# EAGLE design PC (EAGLE 9.6.2)
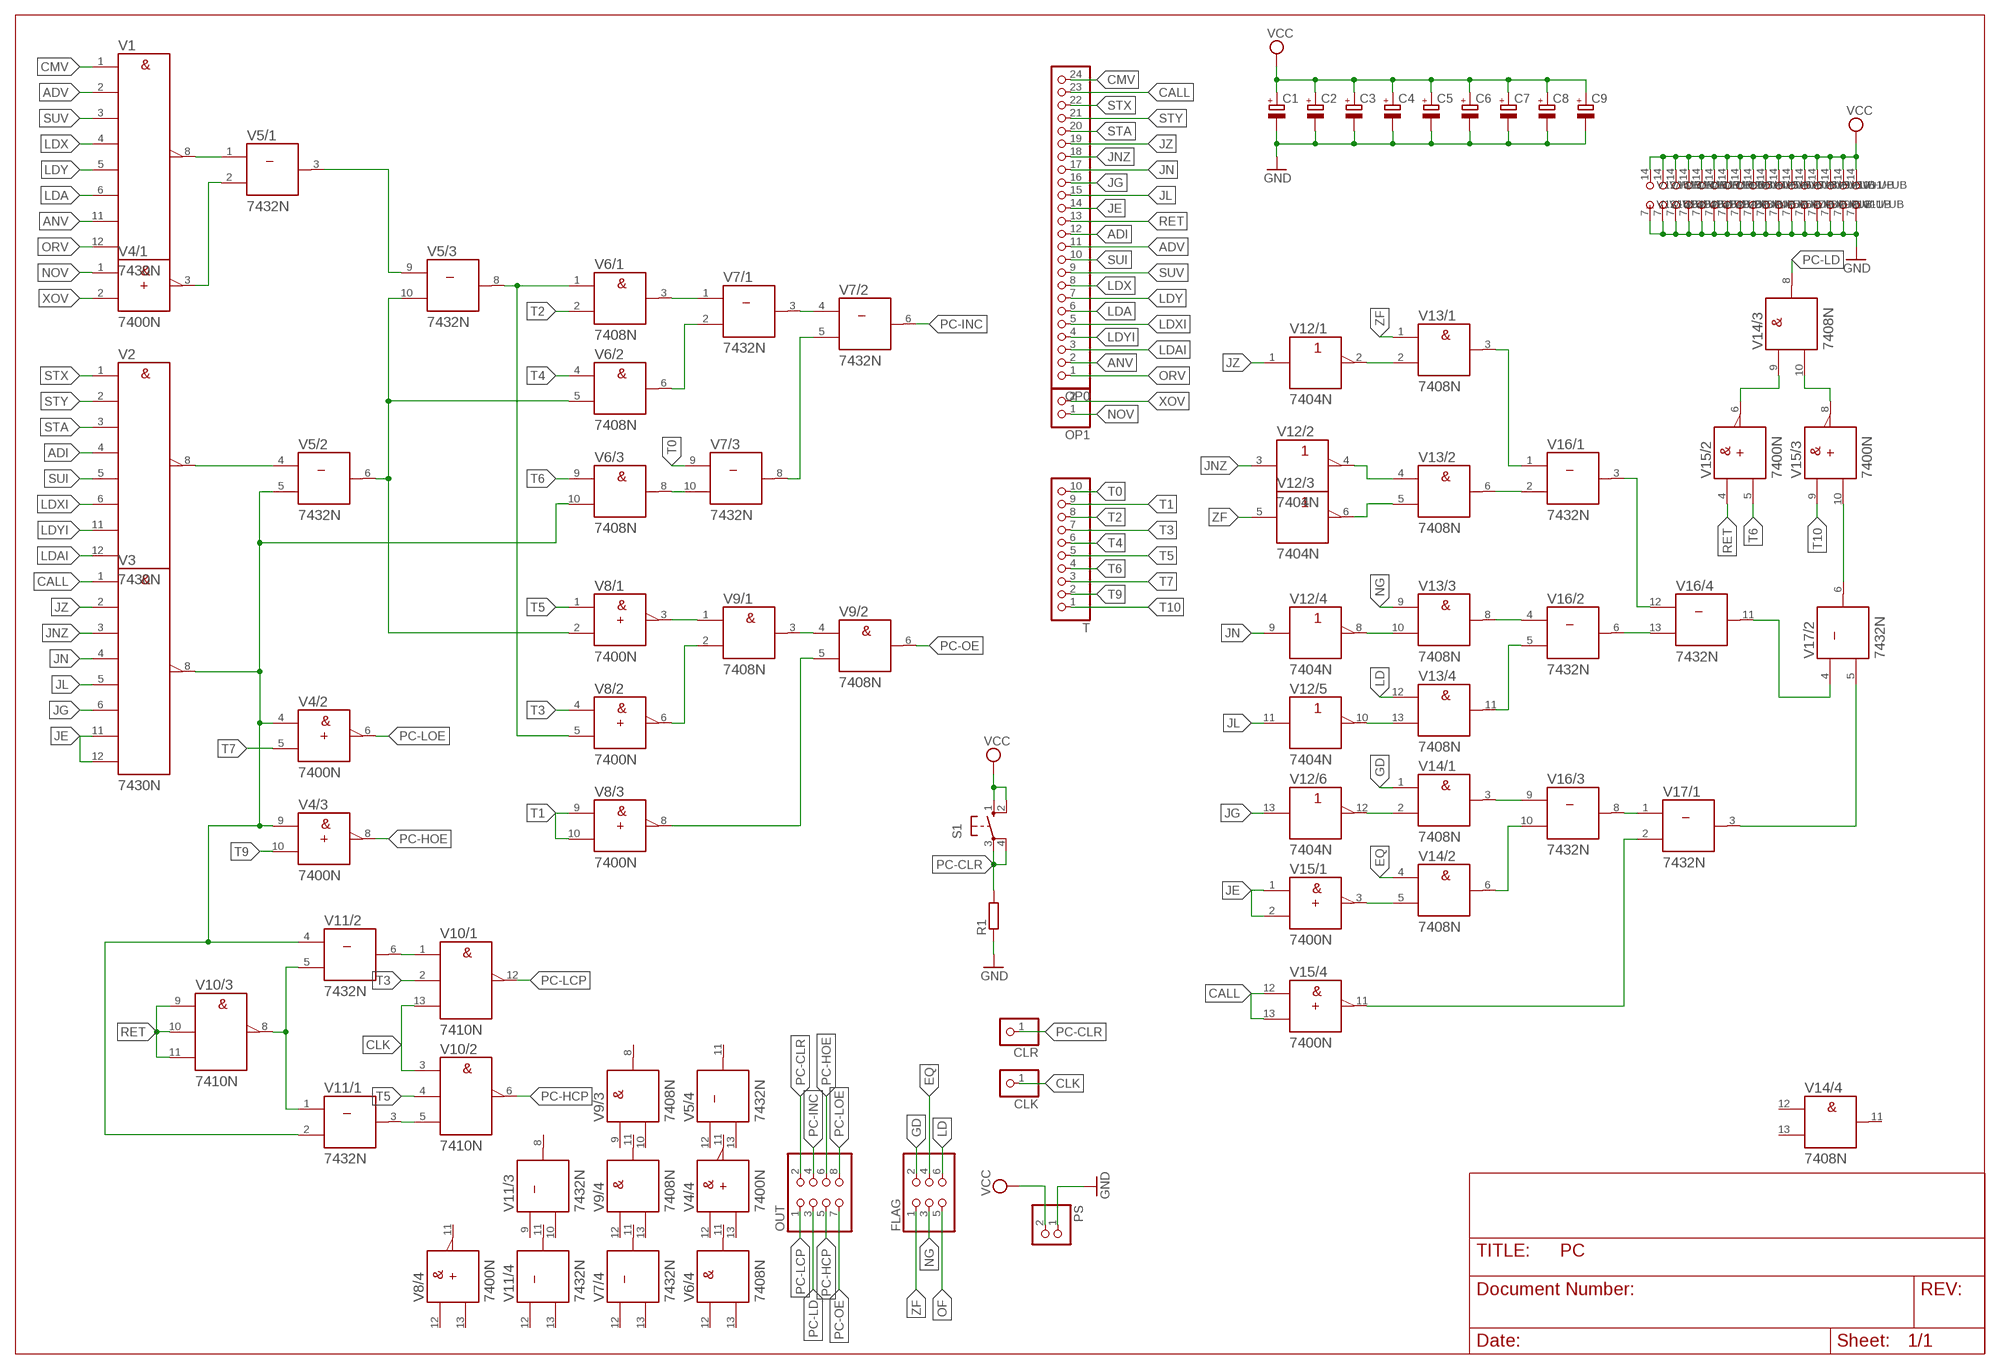
[diagram p0: schematic, sheet 1]

## Parts
C1  CPOL-EUE2.5-6  [E2,5-6]
C2  CPOL-EUE2.5-6  [E2,5-6]
C3  CPOL-EUE2.5-6  [E2,5-6]
C4  CPOL-EUE2.5-6  [E2,5-6]
C5  CPOL-EUE2.5-6  [E2,5-6]
C6  CPOL-EUE2.5-6  [E2,5-6]
C7  CPOL-EUE2.5-6  [E2,5-6]
C8  CPOL-EUE2.5-6  [E2,5-6]
C9  CPOL-EUE2.5-6  [E2,5-6]
CLK  PINHD-1X1  [1X01]
CLR  PINHD-1X1  [1X01]
FLAG  PINHD-2X3  [2X03]
OP0  PINHD-1X24  [1X24]
OP1  PINHD-1X2  [1X02]
OUT  PINHD-2X4  [2X04]
PS  PINHD-1X2  [1X02]
R1  R-EU_0207/7  [0207/7]
S1  10-XX  [B3F-10XX]
T  PINHD-1X10  [1X10]
V1  7430N  [DIL14]
V2  7430N  [DIL14]
V3  7430N  [DIL14]
V4  7400N  [DIL14]
V5  7432N  [DIL14]
V6  7408N  [DIL14]
V7  7432N  [DIL14]
V8  7400N  [DIL14]
V9  7408N  [DIL14]
V10  7410N  [DIL14]
V11  7432N  [DIL14]
V12  7404N  [DIL14]
V13  7408N  [DIL14]
V14  7408N  [DIL14]
V15  7400N  [DIL14]
V16  7432N  [DIL14]
V17  7432N  [DIL14]

## Nets
ADI: OP0.12 V2.4(D)
ADV: OP0.11 V1.2(B)
ANV: OP0.2 V1.11(G)
CALL: OP0.23 V3.1(A) V15.12(/4:A) V15.13(/4:B)
CLK: CLK.1 V10.3(/2:A) V10.13(/1:C)
CMV: OP0.24 V1.1(A)
EQ: FLAG.4 V14.4(/2:A)
GD: FLAG.2 V14.1(/1:A)
GND: C1.- C2.- C3.- C4.- C5.- C6.- C7.- C8.- C9.- PS.1 R1.1 V1.7(-UB) V2.7(-UB) V3.7(-UB) V4.7(/-UB:-UB) V5.7(/-UB:-UB) V6.7(/-UB:-UB) V7.7(/-UB:-UB) V8.7(/-UB:-UB) V9.7(/-UB:-UB) V10.7(/-UB:-UB) V11.7(/-UB:-UB) V12.7(/-UB:-UB) V13.7(/-UB:-UB) V14.7(/-UB:-UB) V15.7(/-UB:-UB) V16.7(/-UB:-UB) V17.7(/-UB:-UB)
JE: OP0.14 V3.11(G) V3.12(H) V15.1(/1:A) V15.2(/1:B)
JG: OP0.16 V3.6(F) V12.13(/6:A)
JL: OP0.15 V3.5(E) V12.11(/5:A)
JN: OP0.17 V3.4(D) V12.9(/4:A)
JNZ: OP0.18 V3.3(C) V12.3(/2:A)
JZ: OP0.19 V3.2(B) V12.1(/1:A)
LD: FLAG.6 V13.12(/4:A)
LDA: OP0.6 V1.6(F)
LDAI: OP0.3 V2.12(H)
LDX: OP0.8 V1.4(D)
LDXI: OP0.5 V2.6(F)
LDY: OP0.7 V1.5(E)
LDYI: OP0.4 V2.11(G)
N$1: V12.2(/1:Y) V13.2(/1:B)
N$2: V13.3(/1:Y) V16.1(/1:A)
N$3: V12.4(/2:Y) V13.4(/2:A)
N$4: V10.5(/2:C) V11.3(/1:Y)
N$5: V12.6(/3:Y) V13.5(/2:B)
N$6: V13.6(/2:Y) V16.2(/1:B)
N$7: V10.1(/1:A) V11.6(/2:Y)
N$8: V10.8(/3:Y) V11.1(/1:A) V11.5(/2:B)
N$9: V12.8(/4:Y) V13.10(/3:B)
N$10: V12.10(/5:Y) V13.13(/4:B)
N$11: V13.8(/3:Y) V16.4(/2:A)
N$12: V13.11(/4:Y) V16.5(/2:B)
N$13: V14.6(/2:Y) V16.10(/3:B)
N$14: V12.12(/6:Y) V14.2(/1:B)
N$15: V14.3(/1:Y) V16.9(/3:A)
N$16: V14.5(/2:B) V15.3(/1:Y)
N$17: V5.6(/2:Y) V5.10(/3:B) V6.5(/2:B) V8.2(/1:B)
N$18: V6.6(/2:Y) V7.2(/1:B)
N$19: V5.8(/3:Y) V6.1(/1:A) V8.5(/2:B)
N$20: V6.3(/1:Y) V7.1(/1:A)
N$21: V7.5(/2:B) V7.8(/3:Y)
N$22: V4.3(/1:Y) V5.2(/1:B)
N$23: V5.3(/1:Y) V5.9(/3:A)
N$24: V7.3(/1:Y) V7.4(/2:A)
N$25: V1.8(Y) V5.1(/1:A)
N$26: V2.8(Y) V5.4(/2:A)
N$27: V3.8(Y) V4.4(/2:A) V4.9(/3:A) V5.5(/2:B) V6.10(/3:B) V11.2(/1:B) V11.4(/2:A)
N$28: V16.6(/2:Y) V16.13(/4:B)
N$29: V6.8(/3:Y) V7.10(/3:B)
N$30: V16.3(/1:Y) V16.12(/4:A)
N$31: V16.8(/3:Y) V17.1(/1:A)
N$32: V8.3(/1:Y) V9.1(/1:A)
N$33: V8.6(/2:Y) V9.2(/1:B)
N$34: V8.8(/3:Y) V9.5(/2:B)
N$35: V9.3(/1:Y) V9.4(/2:A)
N$36: V15.11(/4:Y) V17.2(/1:B)
N$38: V14.10(/3:B) V15.8(/3:Y)
N$39: V14.9(/3:A) V15.6(/2:Y)
N$42: V15.10(/3:B) V17.6(/2:Y)
N$43: V16.11(/4:Y) V17.4(/2:A)
N$44: V17.3(/1:Y) V17.5(/2:B)
NG: FLAG.3 V13.9(/3:A)
NOV: OP1.1 V4.1(/1:A)
OF: FLAG.5
ORV: OP0.1 V1.12(H)
PC-CLR: CLR.1 OUT.2 R1.2 S1.3(P) S1.4(P1)
PC-HCP: OUT.5 V10.6(/2:Y)
PC-HOE: OUT.6 V4.8(/3:Y)
PC-INC: OUT.4 V7.6(/2:Y)
PC-LCP: OUT.1 V10.12(/1:Y)
PC-LD: OUT.3 V14.8(/3:Y)
PC-LOE: OUT.8 V4.6(/2:Y)
PC-OE: OUT.7 V9.6(/2:Y)
RET: OP0.13 V10.9(/3:A) V10.10(/3:B) V10.11(/3:C) V15.4(/2:A)
STA: OP0.20 V2.3(C)
STX: OP0.22 V2.1(A)
STY: OP0.21 V2.2(B)
SUI: OP0.10 V2.5(E)
SUV: OP0.9 V1.3(C)
T0: T.10 V7.9(/3:A)
T1: T.9 V8.9(/3:A) V8.10(/3:B)
T2: T.8 V6.2(/1:B)
T3: T.7 V8.4(/2:A) V10.2(/1:B)
T4: T.6 V6.4(/2:A)
T5: T.5 V8.1(/1:A) V10.4(/2:B)
T6: T.4 V6.9(/3:A) V15.5(/2:B)
T7: T.3 V4.5(/2:B)
T9: T.2 V4.10(/3:B)
T10: T.1 V15.9(/3:A)
VCC: C1.+ C2.+ C3.+ C4.+ C5.+ C6.+ C7.+ C8.+ C9.+ PS.2 S1.1(S) S1.2(S1) V1.14(+UB) V2.14(+UB) V3.14(+UB) V4.14(/+UB:+UB) V5.14(/+UB:+UB) V6.14(/+UB:+UB) V7.14(/+UB:+UB) V8.14(/+UB:+UB) V9.14(/+UB:+UB) V10.14(/+UB:+UB) V11.14(/+UB:+UB) V12.14(/+UB:+UB) V13.14(/+UB:+UB) V14.14(/+UB:+UB) V15.14(/+UB:+UB) V16.14(/+UB:+UB) V17.14(/+UB:+UB)
XOV: OP1.2 V4.2(/1:B)
ZF: FLAG.1 V12.5(/3:A) V13.1(/1:A)
Unconnected: V4.11(/4:Y) V4.12(/4:A) V4.13(/4:B) V5.11(/4:Y) V5.12(/4:A) V5.13(/4:B) V6.11(/4:Y) V6.12(/4:A) V6.13(/4:B) V7.11(/4:Y) V7.12(/4:A) V7.13(/4:B) V8.11(/4:Y) V8.12(/4:A) V8.13(/4:B) V9.8(/3:Y) V9.9(/3:A) V9.10(/3:B) V9.11(/4:Y) V9.12(/4:A) V9.13(/4:B) V11.8(/3:Y) V11.9(/3:A) V11.10(/3:B) V11.11(/4:Y) V11.12(/4:A) V11.13(/4:B) V14.11(/4:Y) V14.12(/4:A) V14.13(/4:B) V17.8(/3:Y) V17.9(/3:A) V17.10(/3:B) V17.11(/4:Y) V17.12(/4:A) V17.13(/4:B)

## Library data of the parts
C1-C9 = rcl:CPOL-EU: POLARIZED CAPACITOR, European symbol; SPICEPREFIX: C
CLK CLR = pinhead:PINHD-1X1: PIN HEADER
FLAG = pinhead:PINHD-2X3: PIN HEADER
OP0 = pinhead:PINHD-1X24: PIN HEADER
OP1 PS = pinhead:PINHD-1X2: PIN HEADER
OUT = pinhead:PINHD-2X4: PIN HEADER
R1 = rcl:R-EU_: RESISTOR, European symbol; SPICEPREFIX: R
S1 = switch-omron:10-XX: OMRON SWITCH; MPN: B3F-1000; OC_FARNELL: 176432; OC_NEWARK: 36M3542
T = pinhead:PINHD-1X10: PIN HEADER
V1-V3 = 74ttl-din:74*30: 8-input NAND gate
V4 V8 V15 = 74ttl-din:74*00: Quad 2-input NAND gate
V5 V7 V11 V16 V17 = 74ttl-din:74*32: Quad 2-input OR gate
V6 V9 V13 V14 = 74ttl-din:74*08: Quad 2-input AND gate
V10 = 74ttl-din:74*10: Triple 3-input NAND gate
V12 = 74ttl-din:74*04: Hex INVERTER

## Board
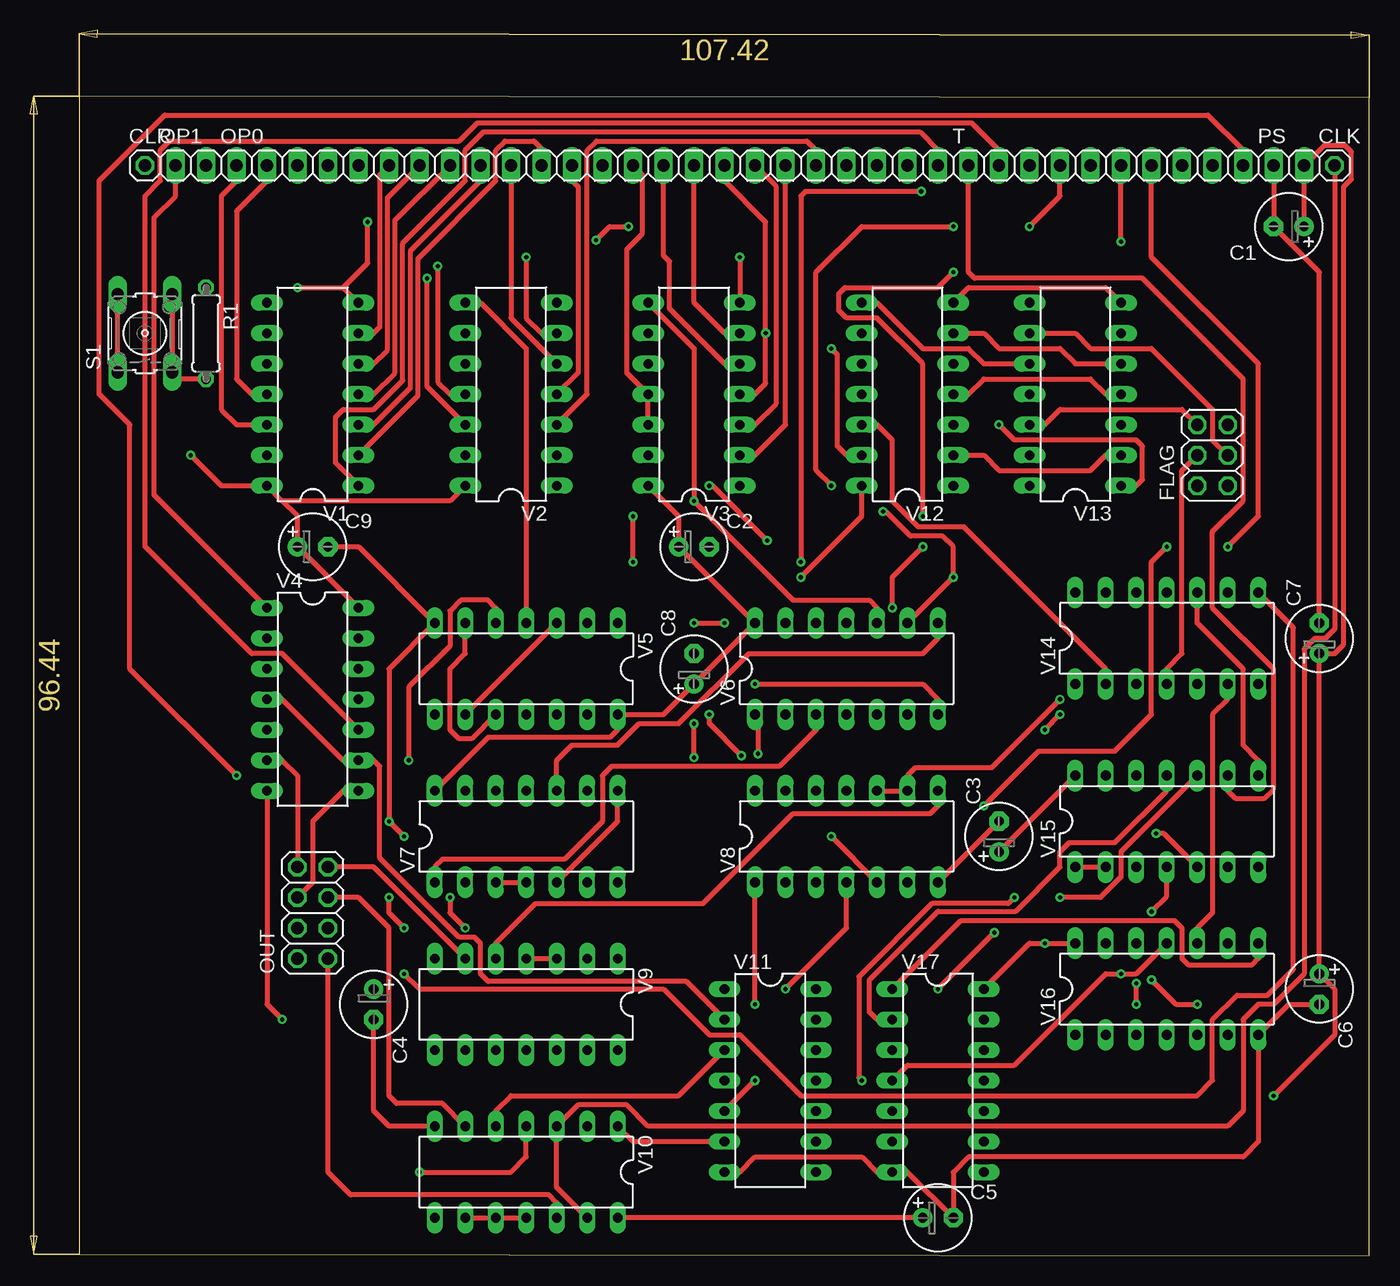
[diagram p1: board, top side]
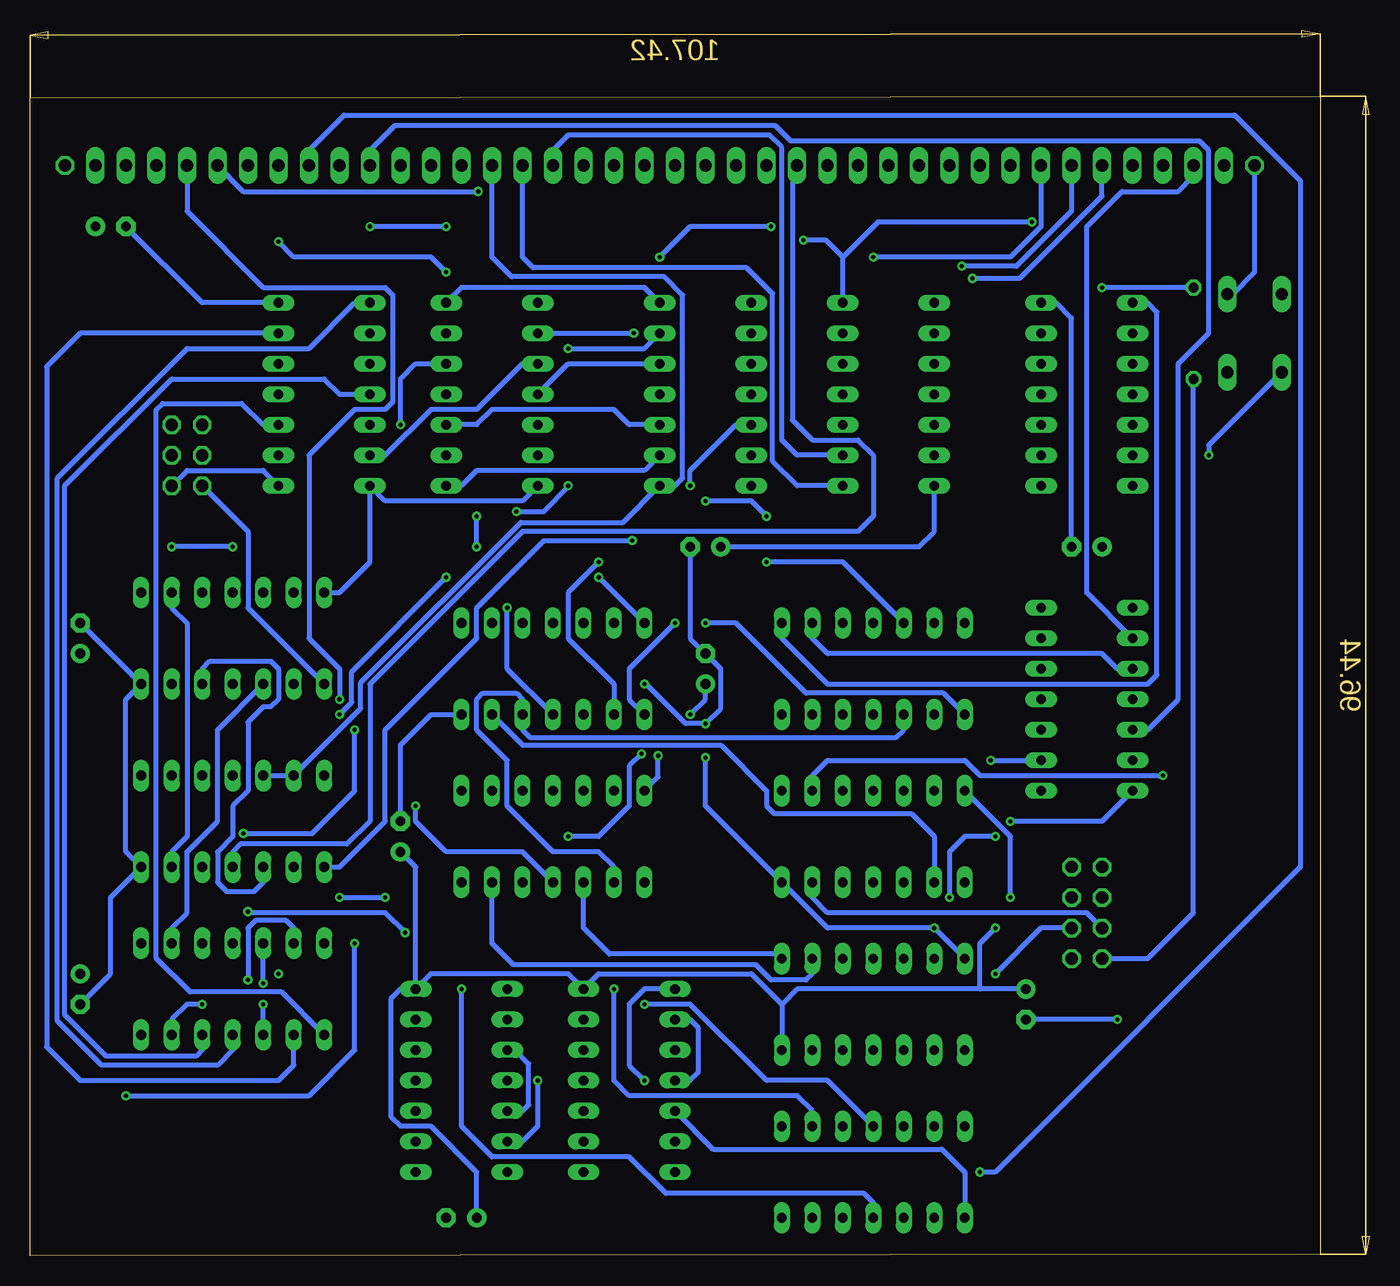
[diagram p2: board, bottom side, seen from below]

Size 107.42 x 96.57 mm. Coordinates in mm from the lower left corner, seen from the top.
Outline: 0,0.13 107.42,0 107.42,96.44 0,96.57 0,0.13
Copper layers (1*16): Top 0.035mm / dielectric 1.5mm / Bottom 0.035mm
Design rules "default": minimum track width 6mil, minimum drill 0.35mm, track to track 6mil, track to pad 6mil, pad to pad 6mil, via to via 6mil, smd to smd 6mil, copper to edge 40mil, drill to drill 6mil, minimum pad ring 10mil, minimum via ring 8mil, stop-mask expansion 4mil, vias tented up to drill 0mil, thermal gap 10mil

### Footprints (pad centres in the part's own frame; a part is rotated, then mirrored left to right if it is on the bottom)
E2,5-6 = drill 0.813 pad 1.6: + -1.27,0 | drill 0.813 pad 1.6 octagon: - 1.27,0
1X01 = drill 1.016 octagon: 1 0,0
2X03 = drill 1.016 octagon: 1 -2.54,-1.27; 2 -2.54,1.27; 3 0,-1.27; 4 0,1.27; 5 2.54,-1.27; 6 2.54,1.27
1X24 = drill 1.016 long: 1 -29.21,0; 2 -26.67,0; 3 -24.13,0; 4 -21.59,0; 5 -19.05,0; 6 -16.51,0; 7 -13.97,0; 8 -11.43,0; 9 -8.89,0; 10 -6.35,0; 11 -3.81,0; 12 -1.27,0; 13 1.27,0; 14 3.81,0; 15 6.35,0; 16 8.89,0; 17 11.43,0; 18 13.97,0; 19 16.51,0; 20 19.05,0; 21 21.59,0; 22 24.13,0; 23 26.67,0; 24 29.21,0
1X02 = drill 1.016 long: 1 -1.27,0; 2 1.27,0
2X04 = drill 1.016 octagon: 1 -3.81,-1.27; 2 -3.81,1.27; 3 -1.27,-1.27; 4 -1.27,1.27; 5 1.27,-1.27; 6 1.27,1.27; 7 3.81,-1.27; 8 3.81,1.27
0207/7 = drill 0.813 octagon: 1 -3.81,0; 2 3.81,0
B3F-10XX = drill 1.016 long: 1 -3.251,2.261; 2 3.251,2.261; 3 -3.251,-2.261; 4 3.251,-2.261
1X10 = drill 1.016 long: 1 -11.43,0; 2 -8.89,0; 3 -6.35,0; 4 -3.81,0; 5 -1.27,0; 6 1.27,0; 7 3.81,0; 8 6.35,0; 9 8.89,0; 10 11.43,0
DIL14 = drill 0.813 long: 1 -7.62,-3.81; 2 -5.08,-3.81; 3 -2.54,-3.81; 4 0,-3.81; 5 2.54,-3.81; 6 5.08,-3.81; 7 7.62,-3.81; 8 7.62,3.81; 9 5.08,3.81; 10 2.54,3.81; 11 0,3.81; 12 -2.54,3.81; 13 -5.08,3.81; 14 -7.62,3.81

### Placement (x,y rotation side)
C1  100.71,85.72 180 top
C2  51.18,59.05 0 top
C3  76.58,34.93 90 top
C4  24.51,20.95 270 top
C5  71.5,3.17 0 top
C6  103.25,22.22 270 top
C7  103.25,51.44 90 top
C8  51.18,48.9 90 top
C9  19.43,59.05 0 top
CLK  104.52,90.8 0 top
CLR  5.46,90.8 0 top
FLAG  94.36,66.67 90 top
OP0  42.29,90.8 0 top
OP1  9.27,90.8 0 top
OUT  19.43,28.57 90 top
PS  100.71,90.8 0 top
R1  10.54,76.83 270 top
S1  5.46,76.83 90 top
T  85.47,90.8 0 top
V1  19.43,71.75 90 top
V2  35.94,71.75 90 top
V3  51.18,71.75 90 top
V4  19.43,46.36 270 top
V5  37.21,48.9 180 top
V6  63.88,48.9 0 top
V7  37.21,34.93 0 top
V8  63.88,34.93 0 top
V9  37.21,20.95 180 top
V10  37.21,6.98 180 top
V11  57.53,14.61 270 top
V12  68.96,71.75 90 top
V13  82.93,71.75 90 top
V14  90.55,51.44 0 top
V15  90.55,36.2 0 top
V16  90.55,22.22 0 top
V17  71.5,14.61 270 top

### Tracks (layer width: path | path; a pad name or v marks a point on that pad's centre or on a via)
ADI
  Top 0.4: OP0.12 41.02,89.53 41.53,89.03 41.53,73.53 V2.4
ADV
  Top 0.4: V1.2 28.19,71.63 28.19,83.06 34.67,89.53 34.67,92.07 35.43,92.84 37.85,92.84 38.48,92.2 OP0.11
ANV
  Top 0.4: OP0.2 15.62,89.53 13.08,86.99 13.08,73.02 14.35,71.75 V1.11
CALL
  Bottom 0.4: OP0.23 68.96,83.19 67.31,81.53 54.61,81.53 53.09,80.01 53.09,64.77 53.72,64.13 V3.1 58.04,61.09 66.55,61.09 79.88,47.75 79.88,45.59 V15.13 V15.12
CLK
  Top 0.4: V10.13 39.75,5.71 V10.3 41.53,12.57 45.59,12.57 47.37,10.79 95.63,10.79 96.9,12.07 96.9,19.68 98.17,20.95 99.44,20.95 101.98,23.49 101.98,50.53 102.89,51.44 103.76,51.44 104.52,52.2 CLK.1
CMV
  Top 0.4: V1.1 21.34,66.04 21.34,69.85 21.97,70.48 24.51,70.48 26.92,72.9 26.92,84.33 32.13,89.53 32.13,92.07 33.66,93.6 69.98,93.6 71.5,92.07 OP0.24
EQ
  Top 0.4: V14.4 90.55,48.9 91.82,50.16 91.82,65.41 FLAG.4
GD
  Bottom 0.4: FLAG.2 89.28,60.33 89.28,53.98 V14.1
GND  (via drill 0.35)
  Top 0.4: V12.7 74.04,80.64 85.47,80.64 V13.7 | C4.- 24.51,12.07 25.78,10.79 V10.7 | V11.7 54.99,6.98 56.26,8.26 65.15,8.26 66.42,6.98 V17.7 68.96,6.98 C5.- 72.77,6.98 74.04,8.26 96.9,8.26 98.17,9.53 V16.7 100.71,20.95 C6.- | C7.- 103.25,81.91 C1.- PS.1 | C9.- 23.24,59.05 V5.7 25.78,48.9 v25.78,36.2 v27.05,34.93 | V8.7 C3.- | v18.16,80.64 21.97,80.64 | 21.97,80.64 V1.7 | 21.97,80.64 24,82.68 v24,86.11 | v16.89,19.68 15.62,20.95 V4.7 | v30.86,29.84 30.86,28.57 v32.13,27.3 | v43.02,84.58 44.16,85.72 v45.72,85.72 | v54.99,83.19 V3.7 | v51.18,41.5 v51.18,44.32 | v56.26,47.62 70.23,47.62 71.5,46.36 V6.7
  Bottom 0.4: V3.7 56.26,80.64 71.5,80.64 V12.7 | R1.1 v18.16,80.64 | v24,86.11 36.83,86.11 39.75,83.19 | V2.7 39.75,83.19 | v16.89,19.68 C4.- | V4.7 18.16,36.2 v25.78,36.2 | v27.05,34.93 29.59,34.93 30.86,33.66 v30.86,29.84 | V9.7 v32.13,27.3 41.02,27.3 V7.7 51.18,37.47 v51.18,41.5 | C6.- 100.71,23.49 100.71,29.84 V15.7 99.44,33.66 99.44,46.36 V14.7 C7.- | C2.- 52.45,51.44 C8.- 49.91,48.9 49.91,45.59 v51.18,44.32 52.83,44.32 56.13,47.62 v56.26,47.62 | V13.7 93.09,79.38 C1.- | C3.- 76.58,42.55 74.04,45.09 V6.7 | 39.75,83.19 41.15,84.58 v43.02,84.58 | v45.72,85.72 52.45,85.72 v54.99,83.19 | C9.- 20.7,78.1 21.97,79.38 V1.7
JE  (via drill 0.35)
  Top 0.4: V3.12 V3.11 45.59,73.53 45.59,83.82 46.86,85.09 46.86,90.04 OP0.14 | V15.1 V15.2 | v57.28,59.56 52.7,64.13 v52.45,64.13
  Bottom 0.4: V15.1 81.66,32.39 77.85,36.2 77.85,43.82 70.23,51.44 70.23,53.98 64.64,59.56 v57.28,59.56 | v52.45,64.13 52.45,65.41 48.64,69.21 V3.12
JG  (via drill 0.35)
  Top 0.4: V3.6 53.72,76.83 51.18,79.38 OP0.16 | V12.13 63.88,66.67 63.12,67.44 63.12,75.06 v62.61,75.56
  Bottom 0.4: v62.61,75.56 56.26,75.56 V3.6
JL
  Top 0.4: V3.5 53.72,74.3 49.15,78.87 49.15,82.8 48.64,83.31 OP0.15
  Bottom 0.4: V12.11 62.61,74.3 V3.5
JN  (via drill 0.35)
  Top 0.4: V3.4 56.26,71.75 57.15,72.64 v57.15,76.83 57.15,86.11 53.72,89.53 OP0.17
  Bottom 0.4: V12.9 v57.15,76.83
JNZ
  Top 0.4: V3.3 56.26,69.21 58.04,70.99 58.04,89.03 OP0.18
  Bottom 0.4: V12.3 70.23,69.21 68.96,70.48 58.8,70.48 57.53,69.21 V3.3
JZ
  Top 0.4: V3.2 56.26,66.67 58.8,69.21 OP0.19
  Bottom 0.4: V3.2 56.26,65.41 70.23,65.41 71.5,64.13 V12.1
LD
  Top 0.4: V13.12 80.39,69.21 81.66,70.48 91.82,70.48 FLAG.6
LDA
  Top 0.4: V1.6 24.51,76.83 25.02,77.34 25.02,90.04 OP0.6
LDAI  (via drill 0.35)
  Top 0.4: V2.12 28.96,72.39 v28.96,81.41
  Bottom 0.4: v28.96,81.41 25.02,81.41 18.16,88.27 OP0.3
LDX
  Top 0.4: V1.4 24.51,71.75 26.29,73.53 26.29,86.23 OP0.8
LDXI  (via drill 0.35)
  Top 0.4: v37.21,83.19 37.21,78.1 38.48,76.83 V2.6
  Bottom 0.4: OP0.5 23.24,85.72 25.78,83.19 v37.21,83.19
LDY
  Top 0.4: V1.5 24.51,74.3 25.65,75.44 25.65,88.14 OP0.7
LDYI  (via drill 0.35)
  Top 0.4: v29.84,82.42 29.84,72.77 30.86,71.75 V2.11
  Bottom 0.4: OP0.4 20.7,86.99 25.27,82.42 v29.84,82.42
N$1
  Top 0.4: V13.2 85.47,66.67 84.2,65.41 76.58,65.41 75.31,66.67 V12.2
N$2
  Bottom 0.4: V16.1 86.49,21.97 94.11,21.97 96.9,24.77 96.9,70.48 96.39,70.99 89.79,70.99 88.01,69.21 V13.3
N$3
  Top 0.4: V12.4 74.04,71.75 75.31,73.02 84.2,73.02 85.47,71.75 V13.4
N$4
  Top 0.4: V10.5 34.67,12.07 35.94,13.34 49.91,13.34 V11.3
N$5
  Top 0.4: V12.6 75.31,76.83 76.58,75.56 81.66,75.56 82.93,74.3 V13.5
N$6
  Bottom 0.4: V16.2 85.47,15.88 86.74,14.61 103.25,14.61 106.05,17.4 106.05,74.04 103.25,76.83 V13.6
N$7
  Top 0.4: V10.1 46.1,9.53 V11.6
N$8  (via drill 0.35)
  Top 0.4: v56.26,14.61 V11.5
  Bottom 0.4: V11.5 50.55,8.89 31.5,8.89 29.59,6.98 V10.8 | V11.1 56.26,22.22 57.53,20.95 57.53,15.88 v56.26,14.61
N$9
  Top 0.4: V12.8 66.42,79.38 70.23,75.56 74.04,75.56 75.31,74.3 V13.10
N$10
  Bottom 0.4: V12.10 66.42,74.3 70.23,70.48 74.04,70.48 77.85,66.67 V13.13
N$11
  Bottom 0.4: V16.4 90.55,17.14 91.82,15.88 101.47,15.88 105.16,19.56 105.16,64.77 94.36,75.56 84.2,75.56 80.39,79.38 V13.8
N$12
  Bottom 0.4: V16.5 93.09,17.14 93.6,16.64 101.09,16.64 104.52,20.07 104.52,64.13 95.63,73.02 82.93,73.02 81.66,71.75 V13.11
N$13
  Top 0.4: V14.6 95.63,46.36 94.36,45.09 94.36,28.57 93.09,27.3 V16.10
N$14
  Top 0.4: V14.2 85.47,48.9 73.66,60.71 69.85,60.71 67.69,62.87 67.69,67.94 66.42,69.21 V12.12
N$15
  Bottom 0.4: V16.9 95.63,27.3 94.36,28.57 94.36,33.66 91.82,36.2 91.82,43.82 V14.3
N$16
  Bottom 0.4: V14.5 93.09,48.9 92.46,49.53 87.38,49.53 86.74,48.9 86.74,46.36 87.38,45.72 88.01,45.72 89.28,44.45 89.28,38.73 90.55,37.47 90.55,34.93 91.82,33.66 91.82,31.11 91.06,30.35 88.77,30.35 88.01,31.11 V15.3
N$17
  Top 0.4: V5.6 32.13,50.16 30.86,48.9 30.86,43.82 31.62,43.05 32.64,43.05 V5.10
  Bottom 0.4: V8.2 58.8,32.39 60.07,33.66 63.88,33.66 67.69,37.47 67.69,41.28 70.23,43.82 70.23,46.36 69.72,46.86 66.93,46.86 66.42,46.36 V6.5 66.42,43.82 65.79,43.18 35.31,43.18 34.67,43.82 V5.10
N$18
  Bottom 0.4: V7.2 32.13,34.93 34.04,36.83 45.47,36.83 46.1,37.47 46.1,38.73 49.91,42.55 66.42,42.55 V6.6
N$19  (via drill 0.35)
  Top 0.4: V6.1 56.52,44.83 v56.52,41.81 | v62.61,34.93 V8.5 | v51.18,52.71 v53.72,52.71
  Bottom 0.4: v56.52,41.81 57.53,40.8 57.53,37.47 60.07,34.93 v62.61,34.93 | v51.18,52.71 48.64,52.71 42.8,46.86 31.37,46.86 V5.8 | v53.72,52.71 57.53,48.9 57.53,46.36 V6.1
N$20
  Top 0.4: V6.3 61.34,43.82 58.29,40.77 44.32,40.77 43.56,40.01 43.56,36.2 40.39,33.02 30.23,33.02 29.59,32.39 V7.1
N$21
  Top 0.4: V7.5 44.83,36.2 V7.8
N$22
  Bottom 0.4: V4.3 16.89,48.9 18.16,50.16 41.02,50.16 42.29,51.44 V5.2
N$23
  Top 0.4: V5.9 V5.3
N$24
  Top 0.4: V7.3 V7.4
N$25
  Bottom 0.4: V5.1 44.83,51.44 41.02,47.62 14.35,47.62 13.59,48.39 13.59,78.61 14.35,79.38 V1.8
N$26
  Top 0.4: V2.8 33.4,79.38 37.21,75.56 V5.4
N$27  (via drill 0.35)
  Top 0.4: V4.4 16.89,46.36 21.97,41.28 V4.9 24.51,41.28 25.02,40.77 25.02,33.15 31.62,26.54 32.89,26.54 33.4,26.04 33.4,23.49 34.04,22.86 50.55,22.86 V11.2 | V6.10 66.42,53.98 65.79,54.61 59.44,54.61 v51.18,62.87 51.18,75.56 V3.8 | v46.1,57.79 v46.1,61.6 | V5.5 34.67,53.98 34.04,54.61 31.75,54.61 30.86,53.72 30.86,50.8 27.43,47.37 v27.43,41.28
  Bottom 0.4: V11.2 52.45,19.68 51.82,19.05 51.82,15.24 52.45,14.61 V11.4 | V5.5 39.75,57.79 v46.1,57.79 | v46.1,61.6 47.37,62.87 v51.18,62.87 | v27.43,41.28 V4.9
N$28  (via drill 0.35)
  Top 0.4: v89.28,22.99 91.31,20.95 v93.09,20.95
  Bottom 0.4: V16.13 85.47,27.3 86.11,27.94 88.65,27.94 89.28,27.3 v89.28,22.99 | v93.09,20.95 94.36,20.95 95.63,19.68 V16.6
N$29
  Top 0.4: V7.10 39.75,41.28 41.02,42.55 44.83,42.55 46.61,44.32 49.91,44.32 55.75,50.16 70.23,50.16 71.5,51.44 V6.8
N$30  (via drill 0.35)
  Top 0.4: v88.01,20.95 v88.01,22.7
  Bottom 0.4: V16.3 v88.01,20.95 | v88.01,22.7 V16.12
N$31
  Top 0.4: V17.1 73.41,27.94 91.19,27.94 91.82,27.3 91.82,24.77 92.33,24.26 97.66,24.26 98.17,24.77 V16.8
N$32
  Bottom 0.4: V9.1 45.21,25.15 59.18,25.15 61.34,27.3 V8.3
N$33
  Bottom 0.4: V9.2 42.29,23.49 42.8,22.99 45.72,22.99 46.99,24.26 67.18,24.26 68.96,26.04 V8.6
N$34
  Top 0.4: V9.5 34.67,26.04 37.97,29.34 51.94,29.34 59.44,36.83 70.87,36.83 71.5,37.47 V8.8
N$35
  Top 0.4: V9.4 V9.3
N$36
  Top 0.4: V17.2 66.42,19.68 65.79,20.32 65.79,22.99 71.5,28.7 77.98,28.7 81.66,32.39 81.66,33.66 82.42,34.42 86.23,34.42 90.55,38.73 V15.11
N$38
  Top 0.4: V15.8 98.17,41.28 96.9,42.55 96.9,48.9 93.09,52.71 V14.10
N$39
  Bottom 0.4: V14.9 95.63,53.98 94.36,52.71 94.36,34.93 95.63,33.66 V15.6
N$42  (via drill 0.35)
  Top 0.4: v81.66,29.84 85.02,29.84 86.74,31.56 86.74,33.66 V15.10 | v77.85,29.84 77.34,29.34 70.99,29.34 64.9,23.24 64.9,14.86 v65.15,14.61
  Bottom 0.4: v81.66,29.84 v77.85,29.84 | v65.15,14.61 65.15,10.79 66.42,9.53 V17.6
N$43  (via drill 0.35)
  Top 0.4: V17.4 68.96,15.88 77.85,15.88 85.47,23.49 v86.74,23.49 88.01,23.49 V16.11
N$44
  Bottom 0.4: V17.5 66.42,12.07 65.91,12.57 65.91,16 67.06,17.14 V17.3
NG
  Top 0.4: V13.9 82.93,76.83 84.2,75.56 89.28,75.56 94.36,70.48 94.36,67.94 FLAG.3
NOV
  Top 0.4: V4.1 6.22,63.37 6.22,86.49 8,88.27 OP1.1
ORV
  Top 0.4: OP0.1 13.08,89.53 11.81,88.27 11.81,70.48 13.08,69.21 V1.12
PC-CLR
  Top 0.4: S1.4 S1.3 8.28,73.02 R1.2
  Bottom 0.4: CLR.1 5.46,81.91 7.29,80.09 S1.4 | OUT.2 14.35,24.77 10.54,28.57 R1.2
PC-HCP
  Top 0.4: OUT.5 23.24,29.84 25.78,27.3 25.78,13.34 26.42,12.7 30.23,12.7 V10.6
PC-HOE
  Top 0.4: V4.8 21.97,38.73 19.43,36.2 19.43,31.11 OUT.6
PC-INC
  Bottom 0.4: OUT.4 19.43,28.57 41.02,28.57 42.29,29.84 V7.6
PC-LCP
  Top 0.4: V10.12 39.75,4.44 39.12,5.08 22.61,5.08 20.7,6.98 OUT.1
PC-LD  (via drill 0.35)
  Top 0.4: v27.05,23.49 28.32,22.22 48.64,22.22 52.45,18.41 54.99,18.41 60.07,13.34 93.09,13.34 94.36,14.61 94.36,19.68 96.39,21.72 98.93,21.72 101.09,23.88 101.09,52.32 V14.8
  Bottom 0.4: OUT.3 23.24,27.3 v27.05,23.49
PC-LOE
  Top 0.4: V4.6 16.89,41.28 18.16,40.01 OUT.8
PC-OE
  Top 0.4: OUT.7 24.51,32.39 V9.6
RET  (via drill 0.35)
  Top 0.4: V10.9 V10.10 V10.11 | v89.28,28.67 90.55,29.94 V15.4 | v71.5,22.22 v76.2,26.92
  Bottom 0.4: OP0.13 43.94,90.42 43.94,69.6 42.29,67.94 38.48,67.94 37.21,66.67 37.21,61.6 38.48,60.33 66.42,60.33 79.12,47.62 79.12,36.2 81.03,34.29 89.92,34.29 90.55,33.66 V15.4 | V10.11 37.21,4.44 37.97,5.21 54.48,5.21 57.53,8.26 68.96,8.26 71.5,10.79 v71.5,22.22 | v76.2,26.92 77.85,28.57 89.28,28.57 v89.28,28.67
STA
  Top 0.4: V2.3 42.29,71.75 42.29,92.07 43.05,92.84 60.58,92.84 61.34,92.07 OP0.20
STX
  Bottom 0.4: OP0.22 66.42,83.19 65.53,82.3 47.75,82.3 45.59,80.14 45.59,66.17 43.56,64.13 V2.1
STY
  Bottom 0.4: V2.2 43.56,66.67 44.83,67.94 44.83,92.33 45.85,93.34 62.61,93.34 63.88,92.07 OP0.21
SUI
  Top 0.4: V2.5 35.94,78.1 OP0.10
SUV
  Top 0.4: OP0.9 33.4,89.53 27.56,83.69 27.56,72.26 24.51,69.21 V1.3
T0  (via drill 0.35)
  Top 0.4: v13.08,40.01 4.19,48.9 4.19,69.21 1.65,71.75 1.65,89.53 7.11,95 93.98,95 96.9,92.07 T.10
  Bottom 0.4: V7.9 42.29,40.01 41.02,41.28 29.59,41.28 28.32,40.01 v13.08,40.01
T1  (via drill 0.35)
  Top 0.4: V8.10 V8.9 68.96,40.01 69.6,40.64 75.95,40.64 v81.66,46.36
  Bottom 0.4: T.9 94.36,86.99 88.01,80.64 77.85,80.64 77.22,80.01 77.22,71.12 77.85,70.48 80.39,70.48 84.2,66.67 84.2,51.44 81.66,48.9 v81.66,46.36
T2  (via drill 0.35)
  Top 0.4: v70.1,88.65 60.45,88.65 60.07,88.27 v60.07,57.79
  Bottom 0.4: T.8 89.66,88.65 v70.1,88.65 | v60.07,57.79 62.61,55.25 62.61,51.44 58.8,47.62 V6.2
T3  (via drill 0.35)
  Top 0.4: v58.8,22.22 63.88,27.3 V8.4 | v75.31,37.47 79.88,42.04 86.23,42.04 89.28,45.09 89.28,57.79 v90.55,59.05 | v95.63,59.05 98.17,61.6 98.17,74.3 89.28,83.19 T.7
  Bottom 0.4: V10.2 42.29,12.07 43.56,13.34 57.53,13.34 58.8,14.61 v58.8,22.22 | V8.4 66.42,33.66 72.77,33.66 75.31,36.2 v75.31,37.47 | v90.55,59.05 v95.63,59.05
T4  (via drill 0.35)
  Top 0.4: v67.69,53.98 67.69,56.52 v70.23,59.05 | v70.23,61.6 70.23,74.3 66.42,78.1 63.88,78.1 63.25,78.74 63.25,80.14 63.75,80.64 71.5,80.64 v72.77,81.91 | v86.74,84.45 T.6
  Bottom 0.4: V6.4 67.69,48.9 v67.69,53.98 | v70.23,59.05 v70.23,61.6 | v72.77,81.91 74.04,83.19 85.47,83.19 v86.74,84.45
T5  (via drill 0.35)
  Top 0.4: v28.32,6.98 35.94,6.98 37.21,8.26 V10.4 | v56.26,20.95 V8.1
  Bottom 0.4: T.5 84.2,92.07 81.28,95 7.11,95 1.65,89.53 1.65,32.39 27.05,6.98 v28.32,6.98 | V10.4 41.02,14.61 46.1,14.61 52.45,20.95 v56.26,20.95
T6  (via drill 0.35)
  Top 0.4: V15.5 90.3,35.18 v89.66,35.18 | v80.39,43.82 v81.66,45.09 | V6.9 v72.77,56.52 72.77,59.05 71.88,59.94 69.22,59.94 67.18,61.98 v66.93,61.98 | v62.61,64.13 61.34,65.41 61.34,81.91 65.15,85.72 v72.77,85.72 | v79.12,85.72 81.66,88.27 T.4
  Bottom 0.4: v89.66,35.18 83.95,35.18 80.39,38.73 v80.39,43.82 | v81.66,45.09 80.64,46.1 80.64,48.64 v72.77,56.52 | v66.93,61.98 64.64,61.98 62.61,64.01 v62.61,64.13 | v72.77,85.72 v79.12,85.72
T7
  Bottom 0.4: V4.5 14.35,43.82 11.81,46.36 11.81,74.3 9.27,76.83 9.27,92.07 10.03,92.84 44.07,92.84 45.34,94.11 77.09,94.11 79.12,92.07 T.3
T9
  Top 0.4: V4.10 16.89,50.16 14.35,50.16 5.46,59.05 5.46,88.27 6.73,89.53 6.73,92.07 7.49,92.84 31.62,92.84 33.15,94.36 74.3,94.36 76.58,92.07 T.2
T10
  Top 0.4: V15.9 95.63,38.73 96.27,38.1 98.68,38.1 99.44,38.86 99.44,48.9 94.36,53.98 94.36,60.33 96.9,62.87 96.9,73.02 88.52,81.41 74.55,81.41 74.04,81.91 T.1
VCC  (via drill 0.35)
  Top 0.4: S1.1 S1.2 | 16.89,62.87 18.16,61.6 C9.+ V4.14 | 16.89,62.87 V1.14 11.81,64.13 v9.27,66.67 | V2.14 30.86,62.87 16.89,62.87 | V3.14 49.91,61.6 C2.+ V6.14 C8.+ 48.64,45.09 V5.14 44.83,43.82 44.2,43.18 34.04,43.18 V7.14 | C5.+ V10.14 | C1.+ PS.2 103.63,92.46 105.41,92.46 105.92,91.95 105.92,89.66 105.28,89.03 105.28,50.93 104.52,50.16 C7.+ C6.+ 104.52,22.22 104.52,18.41 v99.44,13.34 | V17.14 79.12,26.04 v80.39,26.04 V16.14 | C3.+ V15.14 | v27.05,27.3 25.78,28.57 v25.78,29.84 | v60.07,56.52 65.15,61.6 V12.14 | v55.12,41.66 52.45,44.32 v52.45,45.09
  Bottom 0.4: S1.1 9.27,67.51 v9.27,66.67 | C2.+ 33.4,59.05 32.13,60.33 V2.14 | 44.83,20.95 43.56,22.22 28.32,22.22 | 44.83,20.95 V9.14 | C4.+ 28.32,22.22 | v27.05,27.3 28.32,26.04 28.32,22.22 | v25.78,29.84 25.78,34.93 V7.14 | 44.83,20.95 47.37,23.49 60.07,23.49 V11.14 62.61,23.49 74.04,23.49 V17.14 | C5.+ 70.23,6.98 74.04,10.79 76.58,10.79 77.34,11.56 77.34,21.46 76.58,22.22 V17.14 | V6.14 v60.07,56.52 | V14.14 81.66,55.25 79.12,57.79 V13.14 77.85,62.87 66.42,62.87 V12.14 | C3.+ 75.31,32.39 V17.14 | V8.14 55.12,39.88 v55.12,41.66 | v52.45,45.09 51.18,46.36 C8.+ | v99.44,13.34 84.2,13.34 80.39,17.14 v80.39,26.04
XOV
  Bottom 0.4: V4.2 19.43,55.25 19.43,85.72 16.51,88.65 11.81,88.65 10.54,89.92 OP1.2
ZF  (via drill 0.35)
  Top 0.4: V13.1 88.01,64.13 88.52,64.64 88.52,67.44 88.01,67.94 77.85,67.94 v76.58,69.21
  Bottom 0.4: v76.58,69.21 76.58,73.02 75.31,74.3 V12.5 | FLAG.1 94.36,65.41 88.01,65.41 V13.1